# Altium schematic sheet P2-sematik.SchDoc
size A3; DrawnBy: Grupa 1; Revision: v1.0; SheetNumber: 1; SheetTotal: 1; ProjectName: Drugi projekat
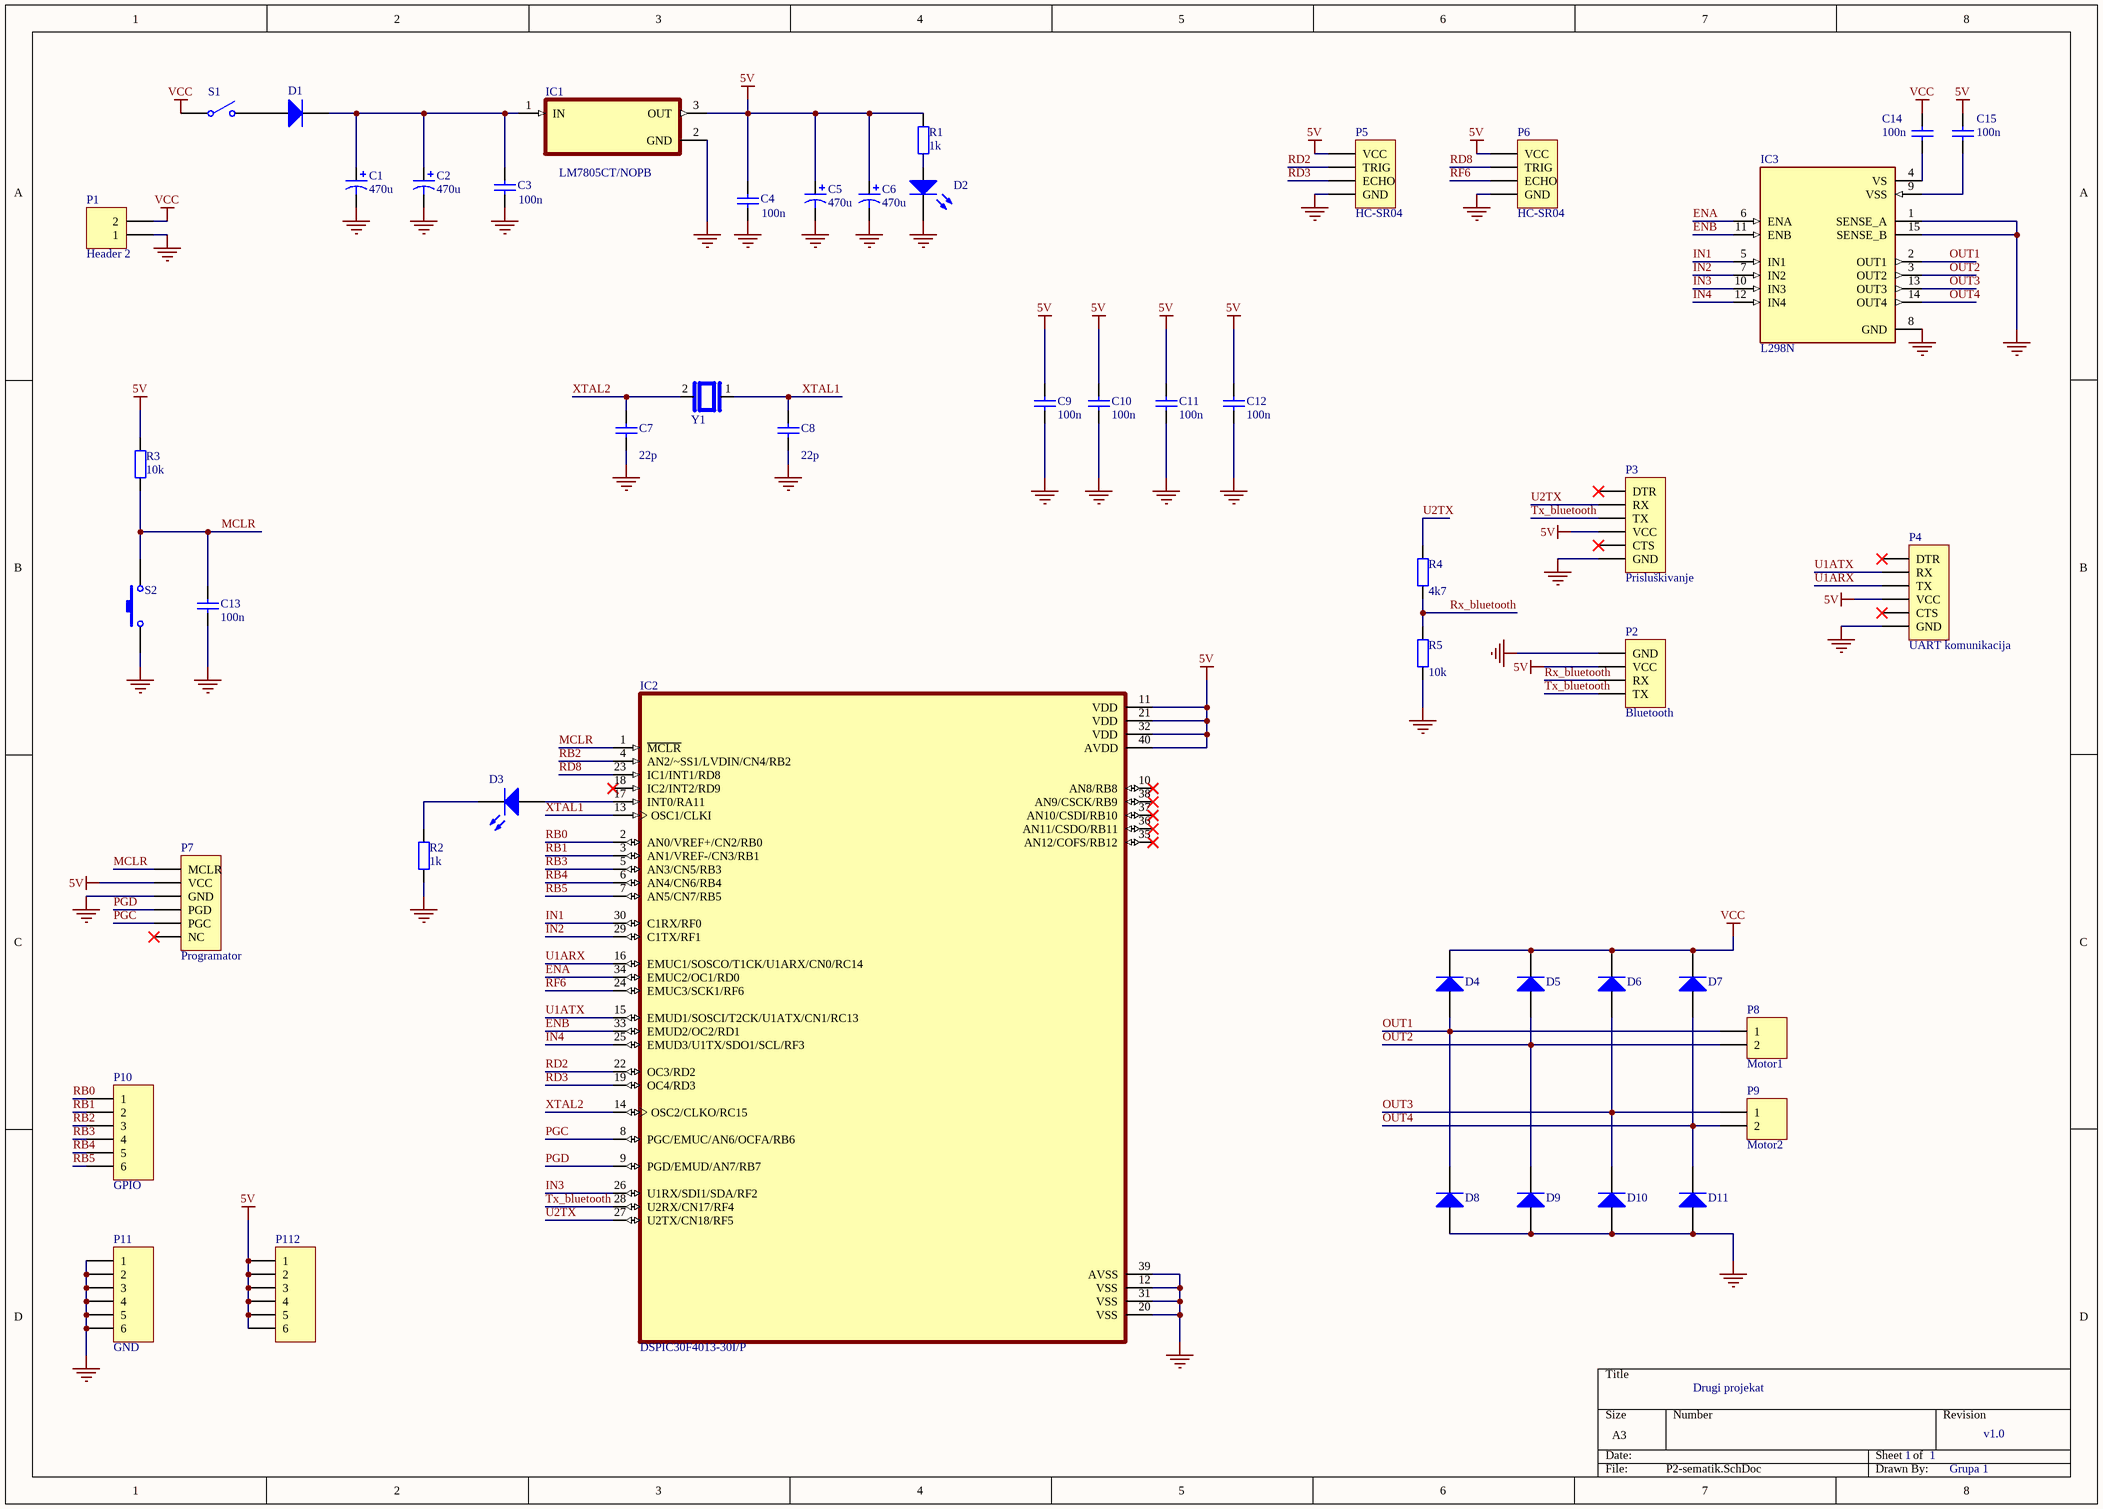
[diagram p0: P2-sematik.SchDoc]

## Parts
C1  value 470u  [elektrolitski kondenzator]  (hidden comment: Cap Pol1)
C2  value 470u  [elektrolitski kondenzator]  (hidden comment: Cap Pol1)
C3  value 100n  [RAD-0.1]  (hidden comment: Cap)
C4  value 100n  [RAD-0.1]  (hidden comment: Cap)
C5  value 470u  [elektrolitski kondenzator]  (hidden comment: Cap Pol1)
C6  value 470u  [elektrolitski kondenzator]  (hidden comment: Cap Pol1)
C7  value 22p  [RAD-0.2]  (hidden comment: Cap)
C8  value 22p  [RAD-0.2]  (hidden comment: Cap)
C9  value 100n  [RAD-0.1]  (hidden comment: Cap)
C10  value 100n  [RAD-0.1]  (hidden comment: Cap)
C11  value 100n  [RAD-0.1]  (hidden comment: Cap)
C12  value 100n  [RAD-0.1]  (hidden comment: Cap)
C13  value 100n  [RAD-0.1]  (hidden comment: Cap)
C14  value 100n  [RAD-0.1]  (hidden comment: Cap)
C15  value 100n  [RAD-0.1]  (hidden comment: Cap)
D1  Diode 1N4007  [DO-41]  (value not drawn)
D2  LED0  [LED dioda]  (value not drawn)
D3  LED0  [LED dioda]  (value not drawn)
D4  Diode 1N4007  [DO-41]  (value not drawn)
D5  Diode 1N4007  [DO-41]  (value not drawn)
D6  Diode 1N4007  [DO-41]  (value not drawn)
D7  Diode 1N4007  [DO-41]  (value not drawn)
D8  Diode 1N4007  [DO-41]  (value not drawn)
D9  Diode 1N4007  [DO-41]  (value not drawn)
D10  Diode 1N4007  [DO-41]  (value not drawn)
D11  Diode 1N4007  [DO-41]  (value not drawn)
IC1  LM7805CT/NOPB  [TO254P1054X470X1955-3]
IC2  DSPIC30F4013-30I/P  [Mikrokontroler]
IC3  L298N  [TO127P2020X500X2100-15]
P1  Header 2  [HDR1X2]
P2  Bluetooth  [HDR1X4]
P3  Prisluškivanje  [HDR1X6]
P4  UART komunikacija  [HDR1X6]
P5  HC-SR04  [HDR1X4]
P6  HC-SR04  [HDR1X4]
P7  Programator  [HDR1X6]
P8  Motor1  [HDR1X2]
P9  Motor2  [HDR1X2]
P10  GPIO  [HDR1X6]
P11  GND  [HDR1X6]
P112  Header 6  [HDR1X6]  (value not drawn)
R1  value 1k  [AXIAL-0.3]  (hidden comment: Res2)
R2  value 1k  [AXIAL-0.3]  (hidden comment: Res2)
R3  value 10k  [AXIAL-0.3]  (hidden comment: Res2)
R4  value 4k7  [AXIAL-0.3]  (hidden comment: Res2)
R5  value 10k  [AXIAL-0.3]  (hidden comment: Res2)
S1  SW-SPST  [SPST-2]  (value not drawn)
S2  SW-PB  [SPST-2]  (value not drawn)
Y1  HC-49/U-S16000000ABJB  [XTAL_HC49P488W43L1150T466H350]  (value not drawn)

## Nets
5V: C4.2 C5.1 C6.1 C9.1 C10.1 C11.1 C12.1 C15.2 IC1.3(OUT) IC2.11(VDD) IC2.21(VDD) IC2.32(VDD) IC2.40(AVDD) P2.2(VCC) P3.4(VCC) P4.4(VCC) P5.1(VCC) P6.1(VCC) P7.2(VCC) P112.1 P112.2 P112.3 P112.4 P112.5 P112.6 R1.2 R3.2
GND: C1.2 C2.2 C3.1 C4.1 C5.2 C6.2 C7.1 C8.1 C9.2 C10.2 C11.2 C12.2 C13.1 D2.2(K) D8.1(A) D9.1(A) D10.1(A) D11.1(A) IC1.2(GND) IC2.12(VSS) IC2.20(VSS) IC2.31(VSS) IC2.39(AVSS) IC3.1(SENSE_A) IC3.8(GND) IC3.15(SENSE_B) P1.1 P2.1(GND) P3.6(GND) P4.6(GND) P5.4(GND) P6.4(GND) P7.3(GND) P11.1 P11.2 P11.3 P11.4 P11.5 P11.6 R2.2 R5.1 S2.1
VCC: C14.2 D4.2(K) D5.2(K) D6.2(K) D7.2(K) P1.2 S1.1(COMMON)
ENA: IC2.34(EMUC2/OC1/RD0) IC3.6(ENA)
ENB: IC2.33(EMUD2/OC2/RD1) IC3.11(ENB)
IN1: IC2.30(C1RX/RF0) IC3.5(IN1)
IN2: IC2.29(C1TX/RF1) IC3.7(IN2)
IN3: IC2.26(U1RX/SDI1/SDA/RF2) IC3.10(IN3)
IN4: IC2.25(EMUD3/U1TX/SDO1/SCL/RF3) IC3.12(IN4)
MCLR: C13.2 IC2.1(~{MCLR}) P7.1(MCLR) R3.1 S2.2
OUT1: D4.1(A) D8.2(K) IC3.2(OUT1) P8.1
OUT2: D5.1(A) D9.2(K) IC3.3(OUT2) P8.2
OUT3: D6.1(A) D10.2(K) IC3.13(OUT3) P9.1
OUT4: D7.1(A) D11.2(K) IC3.14(OUT4) P9.2
PGC: IC2.8(PGC/EMUC/AN6/OCFA/RB6) P7.5(PGC)
PGD: IC2.9(PGD/EMUD/AN7/RB7) P7.4(PGD)
RB0: IC2.2(AN0/VREF+/CN2/RB0) P10.1
RB1: IC2.3(AN1/VREF-/CN3/RB1) P10.2
RB2: IC2.4(AN2/~SS1/LVDIN/CN4/RB2) P10.3
RB3: IC2.5(AN3/CN5/RB3) P10.4
RB4: IC2.6(AN4/CN6/RB4) P10.5
RB5: IC2.7(AN5/CN7/RB5) P10.6
RD2: IC2.22(OC3/RD2) P5.2(TRIG)
RD3: IC2.19(OC4/RD3) P5.3(ECHO)
RD8: IC2.23(IC1/INT1/RD8) P6.2(TRIG)
RF6: IC2.24(EMUC3/SCK1/RF6) P6.3(ECHO)
Rx_bluetooth: P2.3(RX) R4.1 R5.2
Tx_bluetooth: IC2.28(U2RX/CN17/RF4) P2.4(TX) P3.3(TX)
U1ARX: IC2.16(EMUC1/SOSCO/T1CK/U1ARX/CN0/RC14) P4.3(TX)
U1ATX: IC2.15(EMUD1/SOSCI/T2CK/U1ATX/CN1/RC13) P4.2(RX)
U2TX: IC2.27(U2TX/CN18/RF5) P3.2(RX) R4.2
XTAL1: C8.2 IC2.13(OSC1/CLKI) Y1.1
XTAL2: C7.2 IC2.14(OSC2/CLKO/RC15) Y1.2
NetC1_1: C1.1 C2.1 C3.2 D1.2(K) IC1.1(IN)
NetC14_1: C14.1 IC3.4(VS)
NetC15_1: C15.1 IC3.9(VSS)
NetD1_1: D1.1(A) S1.2(NO)
NetD2_1: D2.1(A) R1.1
NetD3_1: D3.1(A) IC2.17(INT0/RA11)
NetD3_2: D3.2(K) R2.1

Not connected (* = marked no-connect by the designer): IC2 10(AN8/RB8)* 18(IC2/INT2/RD9)* 35(AN12/COFS/RB12)* 36(AN11/CSDO/RB11)* 37(AN10/CSDI/RB10)* 38(AN9/CSCK/RB9)*; P3 1(DTR)* 5(CTS)*; P4 1(DTR)* 5(CTS)*; P7 6(NC)*

## Library data of the parts
C1 C2 C5 C6 = Cap Pol1: Polarized Capacitor (Radial); Published: 8-Jun-2000; LatestRevisionDate: 17-Jul-2002; LatestRevisionNote: Re-released for DXP Platform.; PackageReference: RB7.6-15; Publisher: Altium Limited; PackageDescription: Polarized Capacitor (Radial); 2 Leads
C3 C4 C7-C15 = Cap: Capacitor; Published: 8-Jun-2000; LatestRevisionDate: 17-Jul-2002; LatestRevisionNote: Re-released for DXP Platform.; PackageReference: RAD-0.3; Publisher: Altium Limited; PackageDescription: Radial Cap, Thru-Hole; 2 Leads; 0.3 in Pin Spacing
D1 D4-D11 = Diode 1N4007: 1 Amp General Purpose Rectifier; Published: 8-Jun-2000; LatestRevisionDate: 17-Jul-2002; LatestRevisionNote: Re-released for DXP Platform.; DatasheetVersion: 1998; PackageVersion: Aug-1999; PackageReference: DO-41; Publisher: Altium Limited; PackageDescription: Diode, Axial; Body 5.2 x 2.7 mm (LxDia. max), Lead Dia. 0.86 mm (max); Code_JEDEC: DO-204-AL; ComponentLink1Description: Manufacturer Link; ComponentLink1URL: http://www.fairchildsemi.com/; ComponentLink2Description: Datasheet; ComponentLink2URL: http://www.fairchildsemi.com/ds/1N%2F1N4001.pdf
D2 D3 = LED0: Typical INFRARED GaAs LED; Published: 8-Jun-2000; LatestRevisionDate: 08-Jul-2005; LatestRevisionNote: Mech Layer 1 removed.; PackageReference: LED-0; Publisher: Altium Limited; PackageDescription: LED; 2 Leads
IC1 = LM7805CT/NOPB: MF: {'manufacturer': u'Texas Instruments'}; Package: None; Price: None; Value: *; MP: LM7805CT/NOPB; Availability: Unavailable
IC2 = DSPIC30F4013-30I/P: Digital Signal Processors, DSP, DSC General Purpose | Microchip Technology Inc. DSPIC30F4013-30I/P; SnapEDA_Link: https://www.snapeda.com/parts/DSPIC30F4013-30I/P/Microchip/view-part/?ref=snap; Package: DIP-40 Microchip; Value: *; MF: Microchip; MP: DSPIC30F4013-30I/P; Check_prices: https://www.snapeda.com/parts/DSPIC30F4013-30I/P/Microchip/view-part/?ref=eda
IC3 = L298N: Dual Full Bridge Motor Driver 15-Pin(15+Tab) MULTIWATT V Tube; MP: L298N; Availability: Unavailable; Package: None; Value: *; Price: None
P1 P8 P9 = Header 2: Header, 2-Pin; LatestRevisionDate: 17-Jul-2002; LatestRevisionNote: Re-released for DXP Platform.; Publisher: Altium Limited
P2 P5 P6 = Header 4: Header, 4-Pin; LatestRevisionDate: 17-Jul-2002; LatestRevisionNote: Re-released for DXP Platform.; Publisher: Altium Limited
P3 P4 P7 P10 P11 P112 = Header 6: Header, 6-Pin; LatestRevisionDate: 17-Jul-2002; LatestRevisionNote: Re-released for DXP Platform.; Publisher: Altium Limited
R1-R5 = Res2: Resistor; Published: 8-Jun-2000; LatestRevisionDate: 17-Jul-2002; LatestRevisionNote: Re-released for DXP Platform.; PackageReference: AXIAL-0.4; Publisher: Altium Limited; PackageDescription: Axial Device, Thru-Hole; 2 Leads; 0.4 in Pin Spacing
S1 = SW-SPST: Single-Pole, Single-Throw Switch; Published: 24-Mar-1999; LatestRevisionDate: 17-Jul-2002; LatestRevisionNote: Re-released for DXP Platform.; PackageReference: SPST-2; Publisher: Altium Limited; PackageDescription: Switch; 2 Leads
S2 = SW-PB: Switch; Published: 24-Mar-1999; LatestRevisionDate: 17-Jul-2002; LatestRevisionNote: Re-released for DXP Platform.; PackageReference: SPST-2; Publisher: Altium Limited; PackageDescription: Switch; 2 Leads
Y1 = HC-49/U-S16000000ABJB: 16 MHz Â±30ppm Crystal 18pF 50 Ohms HC-49/US; MF: Citizen Finedevice; SnapEDA_Link: https://www.snapeda.com/parts/HC-49/U-S16000000ABJB/Citizen/view-part/?ref=snap; Package: HC-49/US Citizen Finetech Miyota; Value: *; MP: HC-49/U-S16000000ABJB; Check_prices: https://www.snapeda.com/parts/HC-49/U-S16000000ABJB/Citizen/view-part/?ref=eda